# Altium schematic sheet MRAM.SchDoc
size A3; Organization: Altium Limited; Address1: L3, 12a Rodborough Rd; Address2: Frenchs Forest; Address3: NSW; Address4: Australia 2086
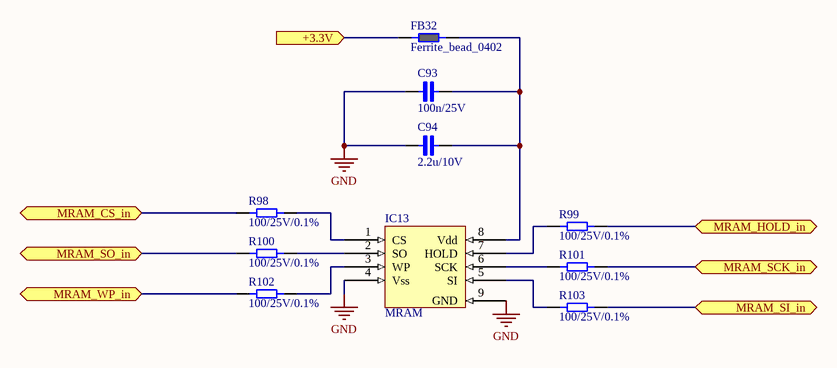
[diagram p0: MRAM.SchDoc]

## Parts
C93  100n/25V  [Cap_0402]
C94  2.2u/10V  [CAP_0603]
FB32  Ferrite_bead_0402  [FERRITE_0402]
IC13  MRAM  [DFN8]
R98  100/25V/0.1%  [RES_0402]
R99  100/25V/0.1%  [RES_0402]
R100  100/25V/0.1%  [RES_0402]
R101  100/25V/0.1%  [RES_0402]
R102  100/25V/0.1%  [RES_0402]
R103  100/25V/0.1%  [RES_0402]

## Ports
+3.3V (in), MRAM_CS_in (bidir), MRAM_HOLD_in (bidir), MRAM_SCK_in (bidir), MRAM_SI_in (bidir), MRAM_SO_in (bidir), MRAM_WP_in (bidir)

## Nets
GND: C93.1 C94.1 IC13.4(Vss) IC13.9(GND)
+3.3V: FB32.1 ; port +3.3V
MRAM_CS_in: R98.1 ; port MRAM_CS_in
MRAM_HOLD_in: R99.2 ; port MRAM_HOLD_in
MRAM_SCK_in: R101.2 ; port MRAM_SCK_in
MRAM_SI_in: R103.2 ; port MRAM_SI_in
MRAM_SO_in: R100.1 ; port MRAM_SO_in
MRAM_WP_in: R102.1 ; port MRAM_WP_in
NetC93_2: C93.2 C94.2 FB32.2 IC13.8(Vdd)
NetIC13_1: IC13.1(CS) R98.2
NetIC13_2: IC13.2(SO) R100.2
NetIC13_3: IC13.3(WP) R102.2
NetIC13_5: IC13.5(SI) R103.1
NetIC13_6: IC13.6(SCK) R101.1
NetIC13_7: IC13.7(HOLD) R99.1

## Notes on the sheet
- Title
- Size:
- Date:
- A3
- Number:
- Time:
- Revision:
- Sheet
- of
- File:

## Library data of the parts
C93 = Cap_0402_100n: Ceramic Capacitor 100n / 0402 / 25V / ±5%, Wurth Elektronik MLCC; ComponentLink1Description: New link; ComponentLink1URL: https://www.we-online.com/catalog/en/WCAP-CSGP-25VDC
C94 = Cap_0603_2.2u: Ceramic Capacitor 2.2uF / 0603 / 10V / ±5%, Wurth Elektronik MLCC
FB32 = Ferrite_bead_0402: Ferrite bead, wurth 74269241102
IC13 = MR25H128A: MRAM, 128Kb Serial SPI MRAM, EVERPIN technologies; ComponentLink1Description: New link; ComponentLink1URL: https://pl.mouser.com/datasheet/2/144/MR25H128A_Datasheet-1219034.pdf
R98-R103 = Res_0402_100: Vishay, thin film resistor 100/25V/0.1%